# Altium schematic sheet 35. PCIe_M.2_INTERFACE SSD.SchDoc: PCIe_M.2_INTERFACE (M Key)
size 513 x 386 mm; Project: PROC154E2(001)_SK_AM69; Issue: 1.0; RevCode: E3; Page Create Date: March  8, 1995; Variant Name: Core Design; Schematic Page Number: 35; Page Number: 35; Page Size: C; Comment: MISTRAL_TITLEBLK_CSIZE_1; Page Count: 62; Schematic Page Count: 62; Name: PROC154E2 001 SK AM69; DsnPath: C:\Users\danie\Downloads\sprr466c\PROC154E3_RP\PROC154E3_SCH.DSN; SchematicName: SCHEMATIC1; PageName: 35. PCIe_M.2_INTERFACE SSD; PageSize: C; TopSchematic: True
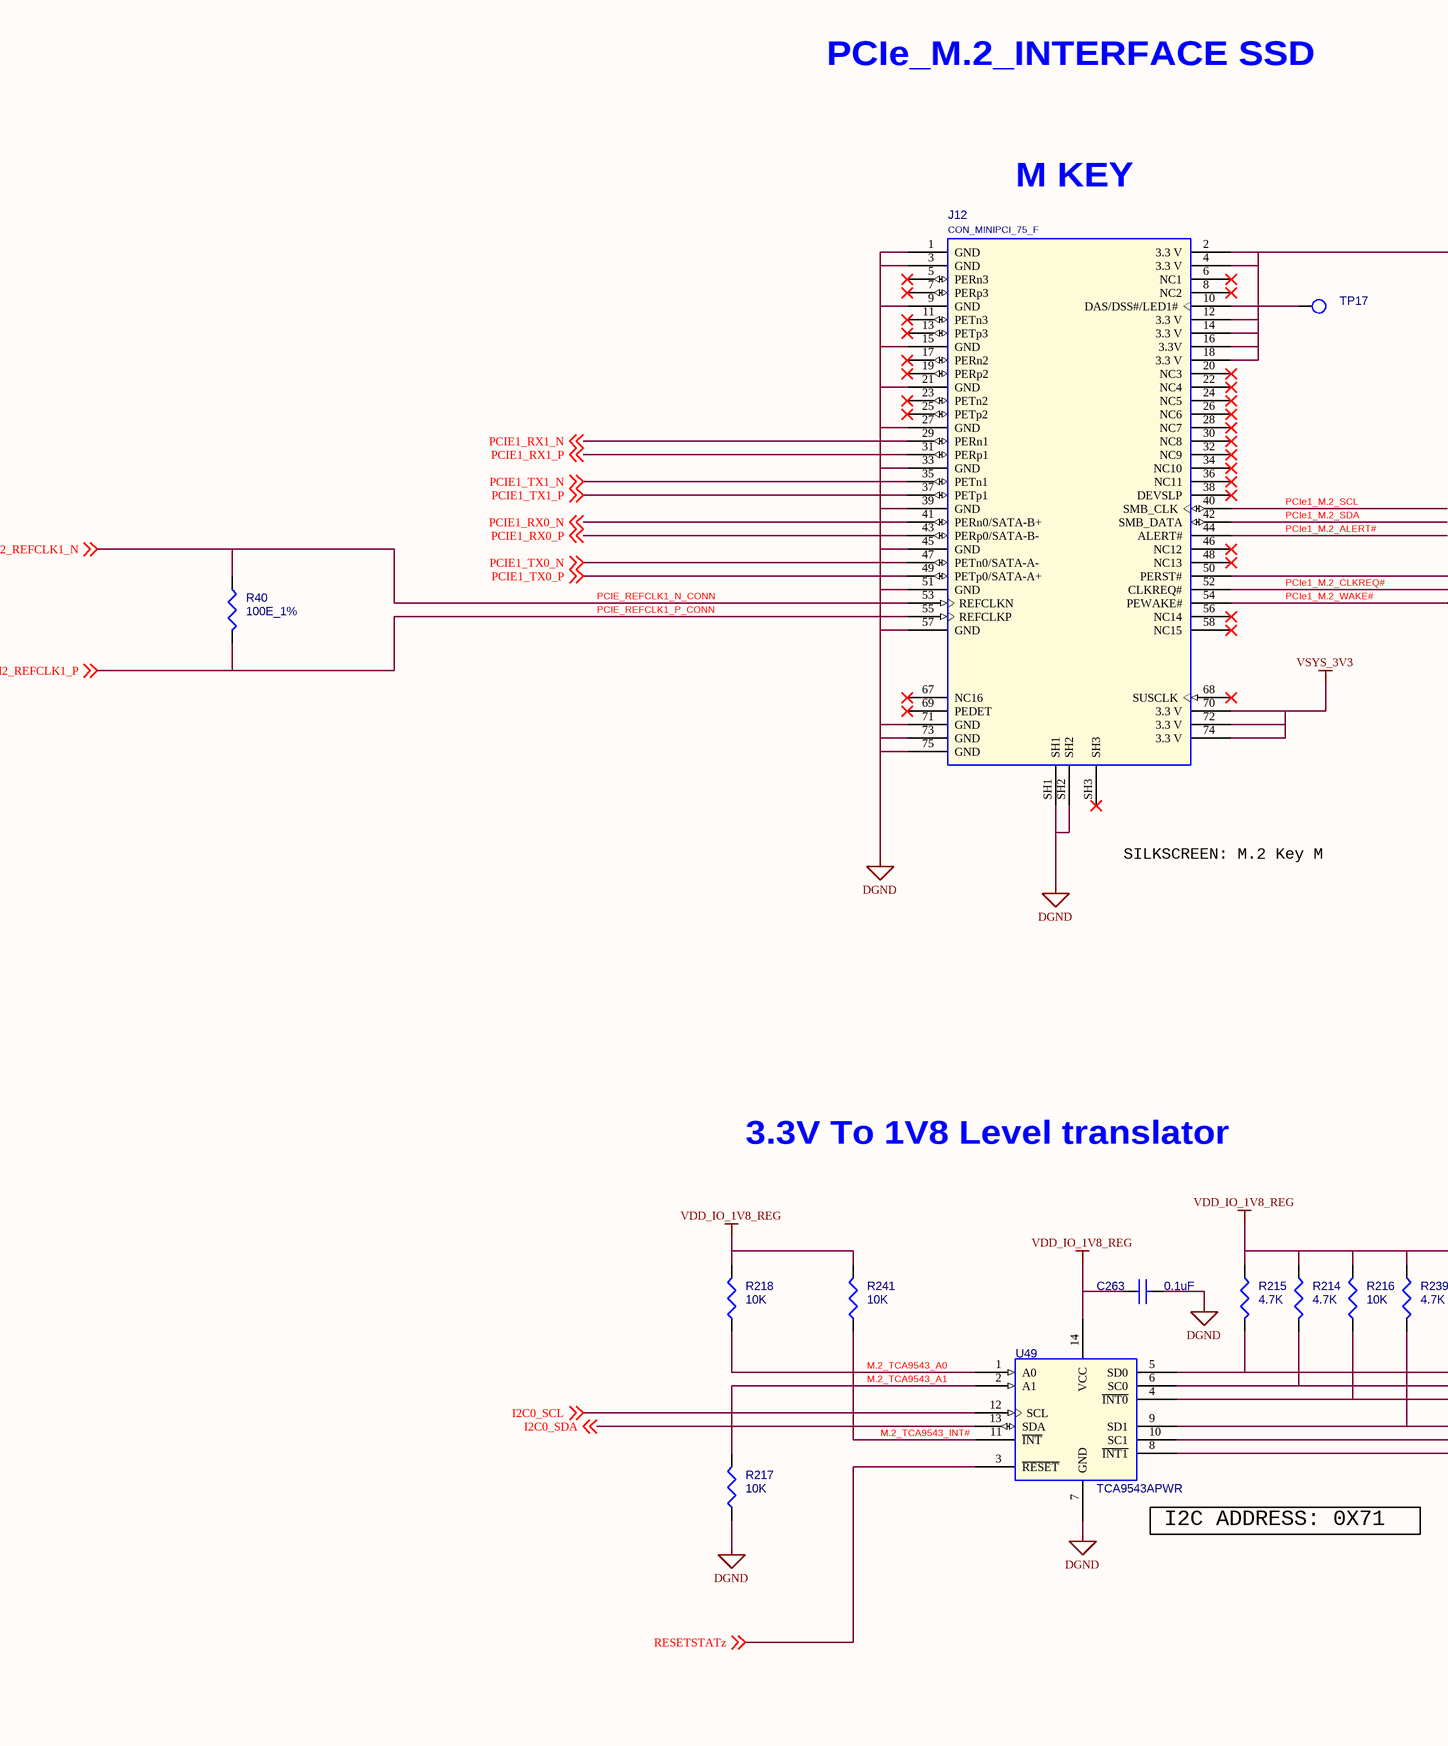
[diagram p0: 35. PCIe_M.2_INTERFACE SSD.SchDoc, left]
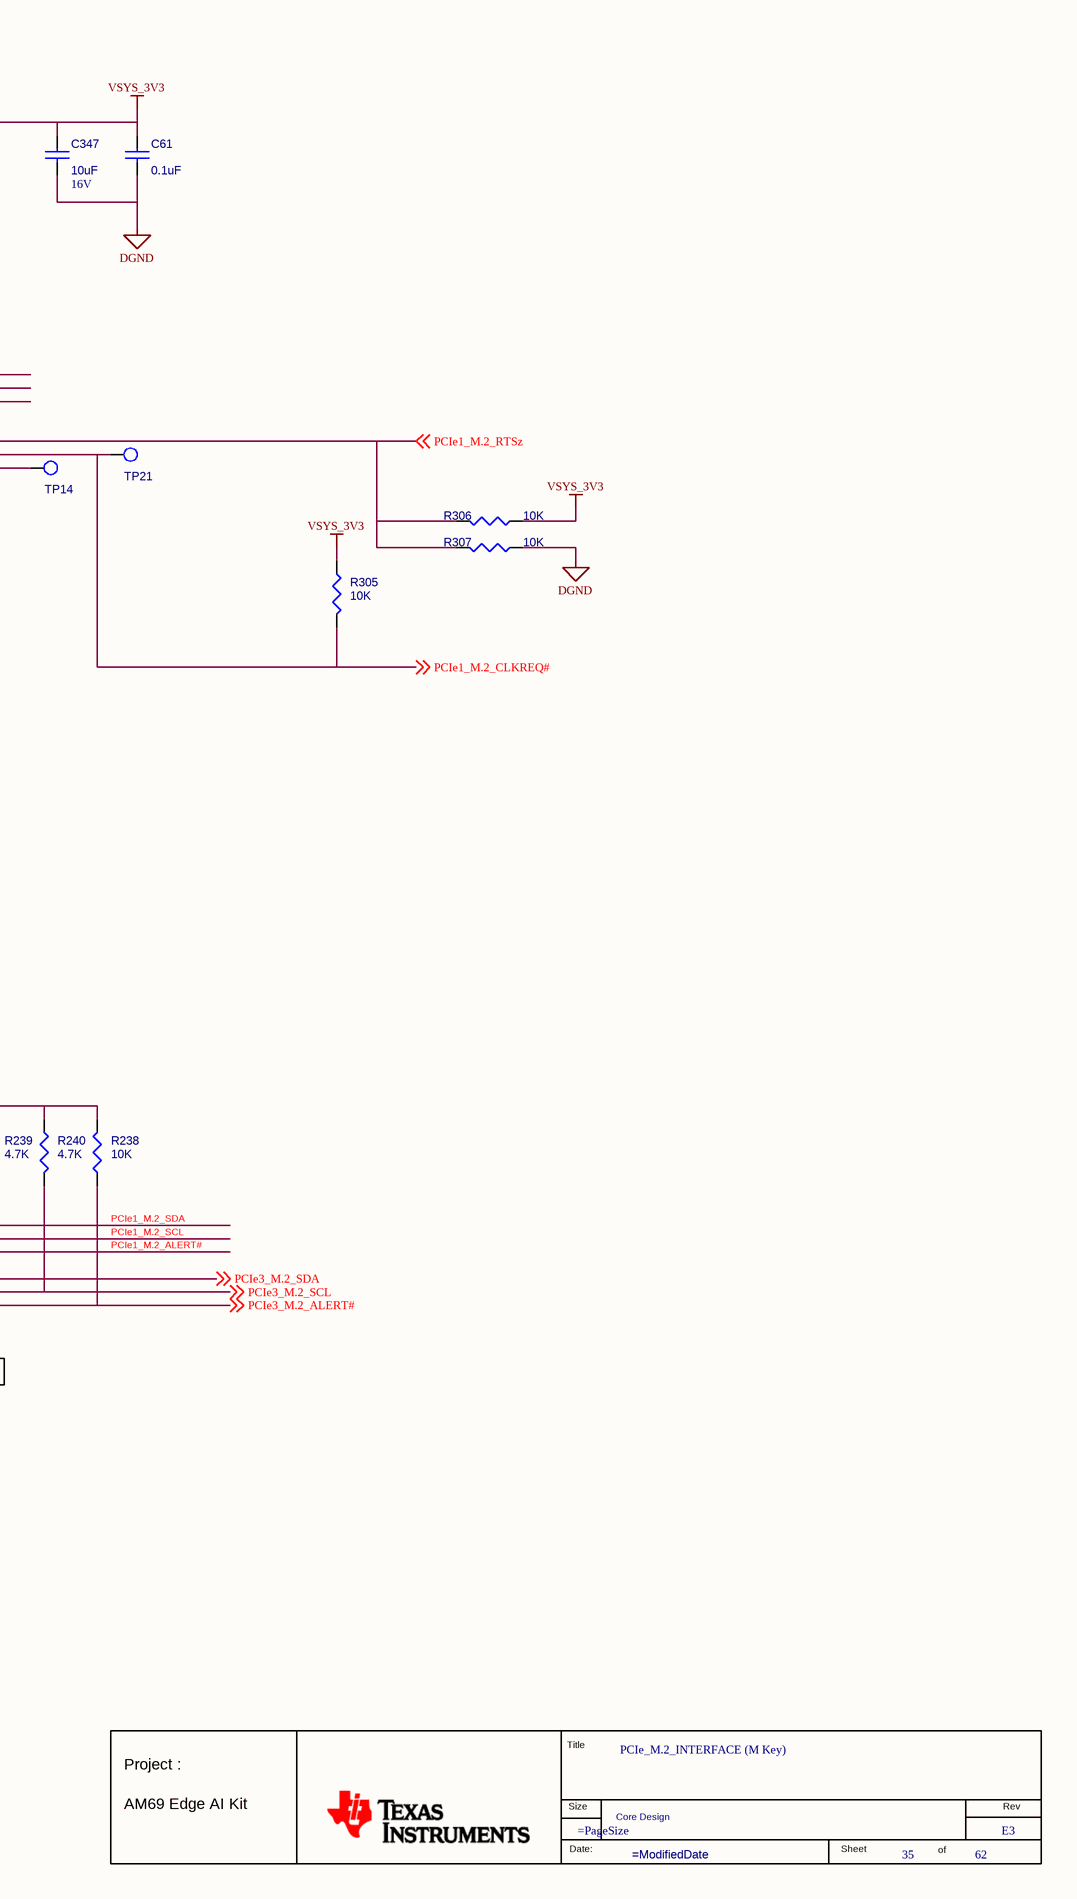
[diagram p1: 35. PCIe_M.2_INTERFACE SSD.SchDoc, right]

## Parts
*  RevCode: E3  Title: PCIe_M.2_INTERFACE (M Key)  Page Number: 35  Page Count: 62  Variant Name: Core Design  (hidden comment: MISTRAL_TITLEBLK_CSIZE_1)  (graphical)
C61  0.1uF  [CAP0201_0-5]
C263  0.1uF  [CAP0201_0-5]
C347  10uF  Voltage: 16V  [CAP0603_1]
J12  CON_MINIPCI_75_F  [CON_MINIPCIE75_MDT320M_S_R_S_3-2_2280]
R40  100E_1%  [RES0402_0-5]
R214  4.7K  [RES0201_0-5]
R215  4.7K  [RES0201_0-5]
R216  10K  [RES0201_0-5]
R217  10K  [RES0201_0-5]
R218  10K  [RES0201_0-5]
R238  10K  [RES0201_0-5]
R239  4.7K  [RES0201_0-5]
R240  4.7K  [RES0201_0-5]
R241  10K  [RES0201_0-5]
R305  10K  [RES0201_0-5]
R306  10K  [RES0402_0-5]
R307  10K  [RES0402_0-5]
TP14  TP30_SMD  [TP30_SMD]  (value not drawn)
TP17  TP30_SMD  [TP30_SMD]  (value not drawn)
TP21  TP30_SMD  [TP30_SMD]  (value not drawn)
U49  TCA9543APWR  [TSSOP14_25-59_205X180]

## Nets
DGND: C61.2 C263.2 C347.2 J12.1(GND) J12.3(GND) J12.9(GND) J12.15(GND) J12.21(GND) J12.27(GND) J12.33(GND) J12.39(GND) J12.45(GND) J12.51(GND) J12.57(GND) J12.71(GND) J12.73(GND) J12.75(GND) J12.SH1 J12.SH2 R217.1 R307.1 U49.7(GND)
VDD_IO_1V8_REG: C263.1 R214.1 R215.1 R216.2 R218.2 R238.2 R239.1 R240.1 R241.2 U49.14(VCC)
VSYS_3V3: C61.1 C347.1 J12.2(3.3_V) J12.4(3.3_V) J12.12(3.3_V) J12.14(3.3_V) J12.16(3.3V) J12.18(3.3_V) J12.70(3.3_V) J12.72(3.3_V) J12.74(3.3_V) R305.2 R306.1
I2C0_SCL: U49.12(SCL) ; off-sheet I2C0_SCL
I2C0_SDA: U49.13(SDA) ; off-sheet I2C0_SDA
M.2_TCA9543_A0: R218.1 U49.1(A0)
M.2_TCA9543_A1: R217.2 U49.2(A1)
M.2_TCA9543_INT#: R241.1 U49.11(~{INT})
PCIe1_M.2_ALERT#: J12.44(ALERT#) R216.1 U49.4(~{INT0})
PCIe1_M.2_CLKREQ#: J12.52(CLKREQ#) R305.1 TP21.1(TP) ; off-sheet PCIe1_M.2_CLKREQ#
PCIe1_M.2_RTSz: J12.50(PERST#) R306.2 R307.2 ; off-sheet PCIe1_M.2_RTSz
PCIe1_M.2_SCL: J12.40(SMB_CLK) R214.2 U49.6(SC0)
PCIe1_M.2_SDA: J12.42(SMB_DATA) R215.2 U49.5(SD0)
PCIe1_M.2_WAKE#: J12.54(PEWAKE#) TP14.1(TP)
PCIE1_RX0_N: J12.41(PERn0/SATA-B+) ; off-sheet PCIE1_RX0_N
PCIE1_RX0_P: J12.43(PERp0/SATA-B-) ; off-sheet PCIE1_RX0_P
PCIE1_RX1_N: J12.29(PERn1) ; off-sheet PCIE1_RX1_N
PCIE1_RX1_P: J12.31(PERp1) ; off-sheet PCIE1_RX1_P
PCIE1_TX0_N: J12.47(PETn0/SATA-A-) ; off-sheet PCIE1_TX0_N
PCIE1_TX0_P: J12.49(PETp0/SATA-A+) ; off-sheet PCIE1_TX0_P
PCIE1_TX1_N: J12.35(PETn1) ; off-sheet PCIE1_TX1_N
PCIE1_TX1_P: J12.37(PETp1) ; off-sheet PCIE1_TX1_P
PCIe3_M.2_ALERT#: R238.1 U49.8(~{INT1}) ; off-sheet PCIe3_M.2_ALERT#
PCIe3_M.2_SCL: R240.2 U49.10(SC1) ; off-sheet PCIe3_M.2_SCL
PCIe3_M.2_SDA: R239.2 U49.9(SD1) ; off-sheet PCIe3_M.2_SDA
PCIE_REFCLK1_N_CONN: J12.53(REFCLKN) R40.2 ; off-sheet PCIE1_M2_REFCLK1_N  [also labelled PCIE1_M2_REFCLK1_N]
PCIE_REFCLK1_P_CONN: J12.55(REFCLKP) R40.1 ; off-sheet PCIE1_M2_REFCLK1_P  [also labelled PCIE1_M2_REFCLK1_P]
RESETSTATz: U49.3(~{RESET}) ; off-sheet RESETSTATz
NetJ12_10: J12.10(DAS/DSS#/LED1#) TP17.1(TP)

Not connected (* = marked no-connect by the designer): J12 5(PERn3)* 6(NC1)* 7(PERp3)* 8(NC2)* 11(PETn3)* 13(PETp3)* 17(PERn2)* 19(PERp2)* 20(NC3)* 22(NC4)* 23(PETn2)* 24(NC5)* 25(PETp2)* 26(NC6)* 28(NC7)* 30(NC8)* 32(NC9)* 34(NC10)* 36(NC11)* 38(DEVSLP)* 46(NC12)* 48(NC13)* 56(NC14)* 58(NC15)* 67(NC16)* 68(SUSCLK)* 69(PEDET)* SH3*

## Notes on the sheet
- PCIe_M.2_INTERFACE SSD
- M KEY
- SILKSCREEN: M.2 Key M
- 3.3V To 1V8 Level translator
- (near U49) I2C ADDRESS: 0X71
- (in symbol MISTRAL_TITLEBLK_CSIZE_1) Title; Project :; Size; Rev; AM69 Edge AI Kit; Date:; Sheet; of

## Library data of the parts
* = MISTRAL_TITLEBLK_CSIZE_1: Issue: 1.0; Project: PROC154E2(001)_SK_AM69; Name: PROC154E2 001 SK AM69; Page Create Date: March  8, 1995; Page Size: =PageSize; Page Modify Date: =ModifiedDate; Schematic Page Count: 62; Schematic Page Number: 35
C61 = CAP_Dup1: CAP CERAMIC 0.1uF 16V 10% X7S AUTO 0201; Part Reference: C61; Mistral Part No: 120021030007-R; Mfr_name: MURATA; Mfr_part_number: GRT033C71C104KE01D; Part_type: CAPACITORS\CERAMIC; Project: J7ES_SK_BRD; Wattage: NA; Customs_HS_Code: 85322990; Custom_Duty: 15%; Value: 0.1uF; Tolerance: 10%; Voltage: 16V; Package: 0201; Distributor_name: DIGIKEY; Distributor_part_number: 490-GRT033C71C104KE01DTR-ND; Height: 0.33MM; Weight: 330mg; Temperature: -55°C+125°C; Datasheet: Y:\MIS_DATABASE\DATASHEETS\CAPACITORS\GRT033C71C104KE01.PDF; Crtd /date: ALVY/110321; Chkd/date: MANIRAJA/110321; MECHANICAL 3D STEP FILE: CAP0201_0-5; PCB Footprint: CAP0201_0-5
C263 = CAP_Dup1: CAP CERAMIC 0.1uF 16V 10% X7S AUTO 0201; Part Reference: C263; Mistral Part No: 120021030007-R; Mfr_name: MURATA; Mfr_part_number: GRT033C71C104KE01D; Part_type: CAPACITORS\CERAMIC; Project: J7ES_SK_BRD; Wattage: NA; Customs_HS_Code: 85322990; Custom_Duty: 15%; Value: 0.1uF; Tolerance: 10%; Voltage: 16V; Package: 0201; Distributor_name: DIGIKEY; Distributor_part_number: 490-GRT033C71C104KE01DTR-ND; Height: 0.33MM; Weight: 330mg; Temperature: -55°C+125°C; Datasheet: Y:\MIS_DATABASE\DATASHEETS\CAPACITORS\GRT033C71C104KE01.PDF; Crtd /date: ALVY/110321; Chkd/date: MANIRAJA/110321; MECHANICAL 3D STEP FILE: CAP0201_0-5; PCB Footprint: CAP0201_0-5
C347 = CAP_Dup1: CAP CERAMIC 10uF 16V 20% X6S AUTO 0603; Part Reference: C347; Automotive Alternate_mfr_part_number: GRT188R61E106ME13D; Automotive Alternate_mfr_name: MURATA; Direct Alternate_mfr_part_number: C1608X5R1E106M080AC; Direct Alternate_mfr_name: TDK; Mistral Part No: 120020090012-R; Mfr_part_number: GRT188C81C106ME13D; Part_type: CAPACITORS\CERAMIC; Project: J7VCL_SOM_LEO_HERA_PMIC_BRD; Wattage: NA; Customs_HS_Code: 85322990; Custom_Duty: 15%; Value: 10uF; Footprint Path: Y:\MIS_DATABASE\Library\ALTIUM_TOOL\PCB_FOOTPRINTS\Altium_Footprint_Lib.PcbLib; Library Path: Y:\MIS_DATABASE\Library\ALTIUM_TOOL\SCHEMATICS_PARTS\MS_DISCRETE_Library.schlib; Footprint Ref: CAP0603_1; Library Ref: CAP; Mfr_name: MURATA; Tolerance: 20%; Package: 0603; Distributor_name: DIGIKEY; Distributor_part_number: 490-12286-1-ND; Height: 1.00MM; Weight: 2mg; Temperature: -55°C+105°C; Datasheet: Y:\MIS_DATABASE\DATASHEETS\CAPACITORS\GRT188C81C106ME13.PDF; Crtd /date: ALVY/170920; Chkd/date: MANIRAJA/180920; MECHANICAL 3D STEP FILE: CAP0603_1; PCB Footprint: CAP0603_1
J12 = CON_MINIPCI_75_MDT320M_2280: CON MINI PCIE 75POS 0.50MM PITCH FEMALE RT SMD; Part Reference: J12; Part_type: CONNECTOR\PCI; Mfr_part_number: MDT320M01001_2280; Mfr_name: AMPHENOL; Mistral Part No: 150018100006-R; Custom_Duty: 24%; Customs_HS_Code: 85369090; Wattage: NA; Project: TI_J7ES_EVM_CP; Value: CON_MINIPCI_75_F; PCB Footprint: CON_MINIPCIE75_MDT320M_S_R_S_3-2_2280; Footprint Path: Y:\MIS_DATABASE\Library\ALTIUM_TOOL\PCB_FOOTPRINTS\Altium_Footprint_Lib.PcbLib; Library Path: Y:\MIS_DATABASE\Library\ALTIUM_TOOL\SCHEMATICS_PARTS\MS_CONNECTOR_Library.schlib; MECHANICAL 3D STEP FILE: CON_MINIPCIE75_MDT320M_S_R_S_3-2_2280; Chkd/date: MANIRAJA/041018; Crtd /date: ALVY/041018; Datasheet: Y:\MIS_DATABASE\DATASHEETS\CONNECTORS\MDTXXX.PDF; Temperature: -40°C+80°C; Weight: NA; Height: 3.20MM; Library Ref: CON_MINIPCI_75_MDT320M_2280; Distributor_part_number: MDT320M01001CT-ND; Distributor_name: DIGIKEY; Package: SMD; Voltage: NA; Tolerance: NA; Footprint Ref: CON_MINIPCIE75_MDT320M_S_R_S_3-2_2280
R40 = RESISTOR_Dup2: RES 100E 1/10W 1% 0402; Part Reference: R40; Mistral Part No: 110018020036-R; Mfr_name: PANASONIC-ECG; Mfr_part_number: ERJ-2RKF1000X; Part_type: RESISTORS\FIXED; Project: CYPHY_FVB; Voltage: NA; Customs_HS_Code: 85332119; Custom_Duty: 15%; Value: 100E_1%; MECHANICAL 3D STEP FILE: RES0402_0-5; Tolerance: 1%; Wattage: 1/10W; Package: 0402; Distributor_name: DIGIKEY; Distributor_part_number: P100LCT-ND; Height: 0.40MM; Weight: 0.8mg; Temperature: -55°C+155°C; Datasheet: Y:\MIS_DATABASE\DATASHEETS\RESISTORS\PAN-ERJSER_NOV17.PDF; Crtd /date: JEBRAN/040715; Chkd/date: MANIRAJA/130617; Library Ref: RESISTOR; Footprint Ref: RES0402_0-5; Library Path: Y:\MIS_DATABASE\Library\ALTIUM_TOOL\SCHEMATICS_PARTS\MS_DISCRETE_Library.schlib; Footprint Path: Y:\MIS_DATABASE\Library\ALTIUM_TOOL\PCB_FOOTPRINTS\Altium_Footprint_Lib.PcbLib; PCB Footprint: RES0402_0-5
R214 = RESISTOR_Dup2: RES 4.7K 1/20W 5% 0201; Part Reference: R214; Part_type: RESISTORS\FIXED; Mfr_part_number: ERJ-1GNJ472C; Mfr_name: PANASONIC-ECG; Mistral Part No: 110010070061-R; Custom_Duty: 15%; Customs_HS_Code: 85332119; Voltage: NA; Project: CUSTOM DCA1000; Value: 4.7K; Chkd/date: MANIRAJA/170420; Crtd /date: ALVY/170420; Datasheet: Y:\MIS_DATABASE\DATASHEETS\RESISTORS\PAN-ERJSER_NOV17.PDF; Temperature: -55°C+125°C; Weight: 0.15mg; Height: 0.26MM; Library Ref: RESISTOR; Distributor_part_number: P4.7AECT-ND; Distributor_name: DIGIKEY; Package: 0201; Wattage: 1/20W; Tolerance: 5%; Footprint Ref: RES0201_0-5; MECHANICAL 3D STEP FILE: RES0201_0-5; Library Path: Y:\MIS_DATABASE\Library\ALTIUM_TOOL\SCHEMATICS_PARTS\MS_DISCRETE_Library.schlib; Footprint Path: Y:\MIS_DATABASE\Library\ALTIUM_TOOL\PCB_FOOTPRINTS\Altium_Footprint_Lib.PcbLib; PCB Footprint: RES0201_0-5
R215 = RESISTOR_Dup2: RES 4.7K 1/20W 5% 0201; Part Reference: R215; Part_type: RESISTORS\FIXED; Mfr_part_number: ERJ-1GNJ472C; Mfr_name: PANASONIC-ECG; Mistral Part No: 110010070061-R; Custom_Duty: 15%; Customs_HS_Code: 85332119; Voltage: NA; Project: CUSTOM DCA1000; Value: 4.7K; Chkd/date: MANIRAJA/170420; Crtd /date: ALVY/170420; Datasheet: Y:\MIS_DATABASE\DATASHEETS\RESISTORS\PAN-ERJSER_NOV17.PDF; Temperature: -55°C+125°C; Weight: 0.15mg; Height: 0.26MM; Library Ref: RESISTOR; Distributor_part_number: P4.7AECT-ND; Distributor_name: DIGIKEY; Package: 0201; Wattage: 1/20W; Tolerance: 5%; Footprint Ref: RES0201_0-5; MECHANICAL 3D STEP FILE: RES0201_0-5; Library Path: Y:\MIS_DATABASE\Library\ALTIUM_TOOL\SCHEMATICS_PARTS\MS_DISCRETE_Library.schlib; Footprint Path: Y:\MIS_DATABASE\Library\ALTIUM_TOOL\PCB_FOOTPRINTS\Altium_Footprint_Lib.PcbLib; PCB Footprint: RES0201_0-5
R216 = RESISTOR_Dup2: RES 10K 1/20W 5% 0201; Part Reference: R216; Part_type: RESISTORS\FIXED; Mfr_part_number: RC0201JR-0710KL; Mfr_name: YAGEO AMERICA; Mistral Part No: 110010070051-R; Custom_Duty: 15%; Customs_HS_Code: 85332119; Voltage: NA; Project: GOLDEN-I LITE; Value: 10K; MECHANICAL 3D STEP FILE: RES0201_0-5; Chkd/date: MANIRAJA/050517; Crtd /date: MANIRAJA/050517; Datasheet: Y:\MIS_DATABASE\DATASHEETS\RESISTORS\RCXXXXL-SER_MAR18.PDF; Temperature: -55°C+125°C; Weight: 0.17mg; Height: 0.26MM; Distributor_part_number: 311-10KNCT-ND; Distributor_name: DIGIKEY; Package: 0201; Wattage: 1/20W; Tolerance: 5%; Library Ref: RESISTOR; Footprint Ref: RES0201_0-5; Library Path: Y:\MIS_DATABASE\Library\ALTIUM_TOOL\SCHEMATICS_PARTS\MS_DISCRETE_Library.schlib; Footprint Path: Y:\MIS_DATABASE\Library\ALTIUM_TOOL\PCB_FOOTPRINTS\Altium_Footprint_Lib.PcbLib; PCB Footprint: RES0201_0-5
R217 = RESISTOR_Dup2: RES 10K 1/20W 5% 0201; Part Reference: R217; Mistral Part No: 110010070051-R; Mfr_name: YAGEO AMERICA; Mfr_part_number: RC0201JR-0710KL; Part_type: RESISTORS\FIXED; Project: GOLDEN-I LITE; Voltage: NA; Customs_HS_Code: 85332119; Custom_Duty: 15%; Value: 10K; Footprint Path: Y:\MIS_DATABASE\Library\ALTIUM_TOOL\PCB_FOOTPRINTS\Altium_Footprint_Lib.PcbLib; Library Path: Y:\MIS_DATABASE\Library\ALTIUM_TOOL\SCHEMATICS_PARTS\MS_DISCRETE_Library.schlib; Footprint Ref: RES0201_0-5; Library Ref: RESISTOR; Tolerance: 5%; Wattage: 1/20W; Package: 0201; Distributor_name: DIGIKEY; Distributor_part_number: 311-10KNCT-ND; Height: 0.26MM; Weight: 0.17mg; Temperature: -55°C+125°C; Datasheet: Y:\MIS_DATABASE\DATASHEETS\RESISTORS\RCXXXXL-SER_MAR18.PDF; Crtd /date: MANIRAJA/050517; Chkd/date: MANIRAJA/050517; MECHANICAL 3D STEP FILE: RES0201_0-5; PCB Footprint: RES0201_0-5
R218 = RESISTOR_Dup2: RES 10K 1/20W 5% 0201; Part Reference: R218; Mistral Part No: 110010070051-R; Mfr_name: YAGEO AMERICA; Mfr_part_number: RC0201JR-0710KL; Part_type: RESISTORS\FIXED; Project: GOLDEN-I LITE; Voltage: NA; Customs_HS_Code: 85332119; Custom_Duty: 15%; Value: 10K; Footprint Path: Y:\MIS_DATABASE\Library\ALTIUM_TOOL\PCB_FOOTPRINTS\Altium_Footprint_Lib.PcbLib; Library Path: Y:\MIS_DATABASE\Library\ALTIUM_TOOL\SCHEMATICS_PARTS\MS_DISCRETE_Library.schlib; Footprint Ref: RES0201_0-5; Library Ref: RESISTOR; Tolerance: 5%; Wattage: 1/20W; Package: 0201; Distributor_name: DIGIKEY; Distributor_part_number: 311-10KNCT-ND; Height: 0.26MM; Weight: 0.17mg; Temperature: -55°C+125°C; Datasheet: Y:\MIS_DATABASE\DATASHEETS\RESISTORS\RCXXXXL-SER_MAR18.PDF; Crtd /date: MANIRAJA/050517; Chkd/date: MANIRAJA/050517; MECHANICAL 3D STEP FILE: RES0201_0-5; PCB Footprint: RES0201_0-5
R238 = RESISTOR_Dup2: RES 10K 1/20W 5% 0201; Part Reference: R238; Mistral Part No: 110010070051-R; Mfr_name: YAGEO AMERICA; Mfr_part_number: RC0201JR-0710KL; Part_type: RESISTORS\FIXED; Project: GOLDEN-I LITE; Voltage: NA; Customs_HS_Code: 85332119; Custom_Duty: 15%; Value: 10K; Footprint Path: Y:\MIS_DATABASE\Library\ALTIUM_TOOL\PCB_FOOTPRINTS\Altium_Footprint_Lib.PcbLib; Library Path: Y:\MIS_DATABASE\Library\ALTIUM_TOOL\SCHEMATICS_PARTS\MS_DISCRETE_Library.schlib; Footprint Ref: RES0201_0-5; Library Ref: RESISTOR; Tolerance: 5%; Wattage: 1/20W; Package: 0201; Distributor_name: DIGIKEY; Distributor_part_number: 311-10KNCT-ND; Height: 0.26MM; Weight: 0.17mg; Temperature: -55°C+125°C; Datasheet: Y:\MIS_DATABASE\DATASHEETS\RESISTORS\RCXXXXL-SER_MAR18.PDF; Crtd /date: MANIRAJA/050517; Chkd/date: MANIRAJA/050517; MECHANICAL 3D STEP FILE: RES0201_0-5; PCB Footprint: RES0201_0-5
R239 = RESISTOR_Dup2: RES 4.7K 1/20W 5% 0201; Part Reference: R239; Part_type: RESISTORS\FIXED; Mfr_part_number: ERJ-1GNJ472C; Mfr_name: PANASONIC-ECG; Mistral Part No: 110010070061-R; Custom_Duty: 15%; Customs_HS_Code: 85332119; Voltage: NA; Project: CUSTOM DCA1000; Value: 4.7K; Chkd/date: MANIRAJA/170420; Crtd /date: ALVY/170420; Datasheet: Y:\MIS_DATABASE\DATASHEETS\RESISTORS\PAN-ERJSER_NOV17.PDF; Temperature: -55°C+125°C; Weight: 0.15mg; Height: 0.26MM; Library Ref: RESISTOR; Distributor_part_number: P4.7AECT-ND; Distributor_name: DIGIKEY; Package: 0201; Wattage: 1/20W; Tolerance: 5%; Footprint Ref: RES0201_0-5; MECHANICAL 3D STEP FILE: RES0201_0-5; Library Path: Y:\MIS_DATABASE\Library\ALTIUM_TOOL\SCHEMATICS_PARTS\MS_DISCRETE_Library.schlib; Footprint Path: Y:\MIS_DATABASE\Library\ALTIUM_TOOL\PCB_FOOTPRINTS\Altium_Footprint_Lib.PcbLib; PCB Footprint: RES0201_0-5
R240 = RESISTOR_Dup2: RES 4.7K 1/20W 5% 0201; Part Reference: R240; Mistral Part No: 110010070061-R; Mfr_name: PANASONIC-ECG; Mfr_part_number: ERJ-1GNJ472C; Part_type: RESISTORS\FIXED; Project: CUSTOM DCA1000; Voltage: NA; Customs_HS_Code: 85332119; Custom_Duty: 15%; Value: 4.7K; Footprint Path: Y:\MIS_DATABASE\Library\ALTIUM_TOOL\PCB_FOOTPRINTS\Altium_Footprint_Lib.PcbLib; Library Path: Y:\MIS_DATABASE\Library\ALTIUM_TOOL\SCHEMATICS_PARTS\MS_DISCRETE_Library.schlib; MECHANICAL 3D STEP FILE: RES0201_0-5; Footprint Ref: RES0201_0-5; Tolerance: 5%; Wattage: 1/20W; Package: 0201; Distributor_name: DIGIKEY; Distributor_part_number: P4.7AECT-ND; Library Ref: RESISTOR; Height: 0.26MM; Weight: 0.15mg; Temperature: -55°C+125°C; Datasheet: Y:\MIS_DATABASE\DATASHEETS\RESISTORS\PAN-ERJSER_NOV17.PDF; Crtd /date: ALVY/170420; Chkd/date: MANIRAJA/170420; PCB Footprint: RES0201_0-5
R241 = RESISTOR_Dup2: RES 10K 1/20W 5% 0201; Part Reference: R241; Mistral Part No: 110010070051-R; Mfr_name: YAGEO AMERICA; Mfr_part_number: RC0201JR-0710KL; Part_type: RESISTORS\FIXED; Project: GOLDEN-I LITE; Voltage: NA; Customs_HS_Code: 85332119; Custom_Duty: 15%; Value: 10K; Footprint Path: Y:\MIS_DATABASE\Library\ALTIUM_TOOL\PCB_FOOTPRINTS\Altium_Footprint_Lib.PcbLib; Library Path: Y:\MIS_DATABASE\Library\ALTIUM_TOOL\SCHEMATICS_PARTS\MS_DISCRETE_Library.schlib; Footprint Ref: RES0201_0-5; Library Ref: RESISTOR; Tolerance: 5%; Wattage: 1/20W; Package: 0201; Distributor_name: DIGIKEY; Distributor_part_number: 311-10KNCT-ND; Height: 0.26MM; Weight: 0.17mg; Temperature: -55°C+125°C; Datasheet: Y:\MIS_DATABASE\DATASHEETS\RESISTORS\RCXXXXL-SER_MAR18.PDF; Crtd /date: MANIRAJA/050517; Chkd/date: MANIRAJA/050517; MECHANICAL 3D STEP FILE: RES0201_0-5; PCB Footprint: RES0201_0-5
R305 = RESISTOR_Dup2: RES 10K 1/20W 5% 0201; Part Reference: R305; Mistral Part No: 110010070051-R; Mfr_name: YAGEO AMERICA; Mfr_part_number: RC0201JR-0710KL; Part_type: RESISTORS\FIXED; Project: GOLDEN-I LITE; Voltage: NA; Customs_HS_Code: 85332119; Custom_Duty: 15%; Value: 10K; PCB Footprint: RES0201_0-5; Footprint Path: Y:\MIS_DATABASE\Library\ALTIUM_TOOL\PCB_FOOTPRINTS\Altium_Footprint_Lib.PcbLib; Library Path: Y:\MIS_DATABASE\Library\ALTIUM_TOOL\SCHEMATICS_PARTS\MS_DISCRETE_Library.schlib; Footprint Ref: RES0201_0-5; Library Ref: RESISTOR; Tolerance: 5%; Wattage: 1/20W; Package: 0201; Distributor_name: DIGIKEY; Distributor_part_number: 311-10KNCT-ND; Height: 0.26MM; Weight: 0.17mg; Temperature: -55°C+125°C; Datasheet: Y:\MIS_DATABASE\DATASHEETS\RESISTORS\RCXXXXL-SER_MAR18.PDF; Crtd /date: MANIRAJA/050517; Chkd/date: MANIRAJA/050517; MECHANICAL 3D STEP FILE: RES0201_0-5
R306 = RESISTOR_Dup2: RES 10K 1/16W 5% 0402; Part Reference: R306; Mistral Part No: 110011060021-R; Mfr_name: YAGEO AMERICA; Mfr_part_number: RC0402JR-0710KL; Part_type: RESISTORS\FIXED; Project: HSE; Voltage: NA; Customs_HS_Code: 85332119; Custom_Duty: 15%; Value: 10K; Footprint Path: Y:\MIS_DATABASE\Library\ALTIUM_TOOL\PCB_FOOTPRINTS\Altium_Footprint_Lib.PcbLib; Library Path: Y:\MIS_DATABASE\Library\ALTIUM_TOOL\SCHEMATICS_PARTS\MS_DISCRETE_Library.schlib; Footprint Ref: RES0402_0-5; Library Ref: RESISTOR; Tolerance: 5%; Wattage: 1/16W; Package: 0402; Distributor_name: DIGIKEY; Distributor_part_number: 311-10KJRCT-ND; Height: 0.40MM; Weight: 0.65mg; Temperature: -55°C+155°C; Datasheet: Y:\MIS_DATABASE\DATASHEETS\RESISTORS\RCXXXXL-SER_MAR18.PDF; Crtd /date: MAZHAR/230805; Chkd/date: VASANTHA/061216; MECHANICAL 3D STEP FILE: RES0402_0-5; PCB Footprint: RES0402_0-5
R307 = RESISTOR_Dup2: RES 10K 1/16W 5% 0402; Part Reference: R307; Mistral Part No: 110011060021-R; Mfr_name: YAGEO AMERICA; Mfr_part_number: RC0402JR-0710KL; Part_type: RESISTORS\FIXED; Project: HSE; Voltage: NA; Customs_HS_Code: 85332119; Custom_Duty: 15%; Value: 10K; Footprint Path: Y:\MIS_DATABASE\Library\ALTIUM_TOOL\PCB_FOOTPRINTS\Altium_Footprint_Lib.PcbLib; Library Path: Y:\MIS_DATABASE\Library\ALTIUM_TOOL\SCHEMATICS_PARTS\MS_DISCRETE_Library.schlib; Footprint Ref: RES0402_0-5; Library Ref: RESISTOR; Tolerance: 5%; Wattage: 1/16W; Package: 0402; Distributor_name: DIGIKEY; Distributor_part_number: 311-10KJRCT-ND; Height: 0.40MM; Weight: 0.65mg; Temperature: -55°C+155°C; Datasheet: Y:\MIS_DATABASE\DATASHEETS\RESISTORS\RCXXXXL-SER_MAR18.PDF; Crtd /date: MAZHAR/230805; Chkd/date: VASANTHA/061216; MECHANICAL 3D STEP FILE: RES0402_0-5; PCB Footprint: RES0402_0-5
TP14 = TESTPOINT_Dup1: TESTPOINT CIR 30 SMD; Part Reference: TP14; Mfr_name: LOCAL; Mistral Part No: 130009030930; MECHANICAL 3D STEP FILE: NA; Project: BT MODULE_CSRBC04; Value: TP30_SMD; Footprint Path: Y:\MIS_DATABASE\Library\ALTIUM_TOOL\PCB_FOOTPRINTS\Altium_Footprint_Lib.PcbLib; Library Path: Y:\MIS_DATABASE\Library\ALTIUM_TOOL\SCHEMATICS_PARTS\MS_DISCRETE_Library.schlib; Custom_Duty: NA; Customs_HS_Code: NA; RoHS: NA; Temperature: NA; Weight: NA; Wattage: NA; Voltage: NA; Tolerance: NA; Footprint Ref: TP30_SMD; Datasheet: NA; Chkd/date: SHREESHAIL/171006; Crtd /date: MAZHAR/171006; Height: NA; Distributor_part_number: NA; Distributor_name: NA; Package: SMD; Part_type: TESTPOINT; Mfr_part_number: TP30_SMD; Library Ref: TESTPOINT; PCB Footprint: TP30_SMD
TP17 = TESTPOINT_Dup1: TESTPOINT CIR 30 SMD; Part Reference: TP17; Mfr_name: LOCAL; Mistral Part No: 130009030930; MECHANICAL 3D STEP FILE: NA; Project: BT MODULE_CSRBC04; Value: TP30_SMD; Footprint Path: Y:\MIS_DATABASE\Library\ALTIUM_TOOL\PCB_FOOTPRINTS\Altium_Footprint_Lib.PcbLib; Library Path: Y:\MIS_DATABASE\Library\ALTIUM_TOOL\SCHEMATICS_PARTS\MS_DISCRETE_Library.schlib; Custom_Duty: NA; Customs_HS_Code: NA; RoHS: NA; Temperature: NA; Weight: NA; Wattage: NA; Voltage: NA; Tolerance: NA; Footprint Ref: TP30_SMD; Datasheet: NA; Chkd/date: SHREESHAIL/171006; Crtd /date: MAZHAR/171006; Height: NA; Distributor_part_number: NA; Distributor_name: NA; Package: SMD; Part_type: TESTPOINT; Mfr_part_number: TP30_SMD; Library Ref: TESTPOINT; PCB Footprint: TP30_SMD
TP21 = TESTPOINT_Dup1: TESTPOINT CIR 30 SMD; Part Reference: TP21; Mistral Part No: 130009030930; Mfr_name: LOCAL; Project: BT MODULE_CSRBC04; Tolerance: NA; Value: TP30_SMD; PCB Footprint: TP30_SMD; Library Ref: TESTPOINT; Mfr_part_number: TP30_SMD; Part_type: TESTPOINT; Package: SMD; Distributor_name: NA; Distributor_part_number: NA; Height: NA; Crtd /date: MAZHAR/171006; Chkd/date: SHREESHAIL/171006; Datasheet: NA; Footprint Ref: TP30_SMD; Voltage: NA; Wattage: NA; Weight: NA; Temperature: NA; RoHS: NA; Customs_HS_Code: NA; Custom_Duty: NA; MECHANICAL 3D STEP FILE: NA; Library Path: Y:\MIS_DATABASE\Library\ALTIUM_TOOL\SCHEMATICS_PARTS\MS_DISCRETE_Library.schlib; Footprint Path: Y:\MIS_DATABASE\Library\ALTIUM_TOOL\PCB_FOOTPRINTS\Altium_Footprint_Lib.PcbLib
U49 = TCA9543APWR_TSSOP14: IC 2-CHANNEL I2C BUS SWITCH WITH RESET TSSOP14; Part Reference: U49; Part_type: ICS\DIGITAL\BUSTRANSCEIVER; Mfr_name: TEXAS INSTRUMENTS; Mistral Part No: 141016030006-R; Wattage: NA; Project: OCTASIC_3600; Value: TCA9543APWR; Chkd/date: VASANTHA/060516; Crtd /date: VASANTHA/070316; Datasheet: Y:\MIS_DATABASE\DATASHEETS\ICS\DIGITAL\BUSTRANSCEIVER\TCA9543A.PDF; Temperature: -40°C+85°C; Weight: NA; Height: 1.20MM; Library Ref: TCA9543APWR_TSSOP14; Distributor_part_number: 296-42157-1-ND; Distributor_name: DIGIKEY; Package: TSSOP14; Voltage: NA; Tolerance: NA; Mfr_part_number: TCA9543APWR; PCB Footprint: TSSOP14_25-59_205X180